# Altium schematic sheet power DCDC steup 33.SchDoc
size Letter
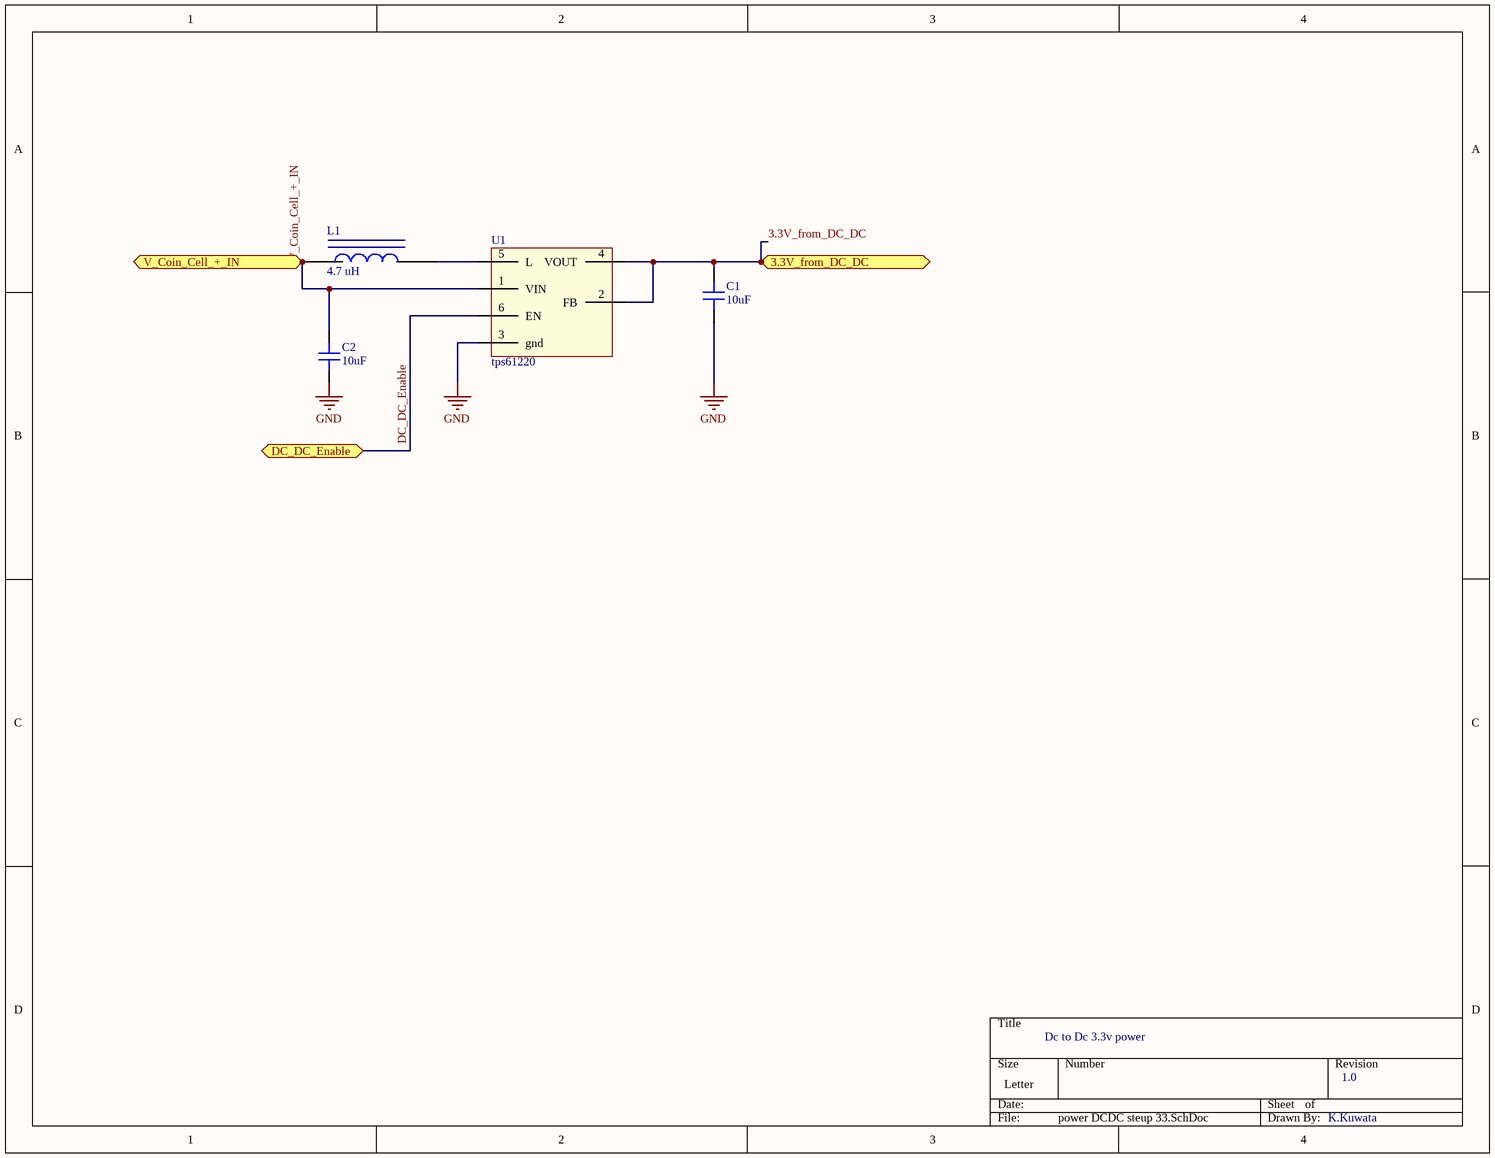
[diagram p0: power DCDC steup 33.SchDoc]

## Parts
C1  10uF  [CAP 0402/1005]
C2  10uF  [CAP 0402/1005]
L1  4.7 uH  [4.7 uH 1008 case]
U1  tps61220  [SOT65P210X110-6N]

## Ports
3.3V_from_DC_DC, DC_DC_Enable, V_Coin_Cell_+_IN

## Nets
GND: C1.1 C2.1 U1.3(gnd)
3.3V_from_DC_DC: C1.2 U1.2(FB) U1.4(VOUT) ; port 3.3V_from_DC_DC
DC_DC_Enable: U1.6(EN) ; port DC_DC_Enable
V_Coin_Cell_+_IN: C2.2 L1.1 U1.1(VIN) ; port V_Coin_Cell_+_IN
NetL1_2: L1.2 U1.5(L)

## Notes on the sheet
- Dc to Dc 3.3v power
- 1.0
- K.Kuwata

## Library data of the parts
C1 C2 = C1005X7R1C104K050BC: CAP CER 0.1UF 16V X7R 0402; Manufacturer: TDK Corporation; TemperatureRange: -55C ~ 125C; Tolerance: 10%; Voltage: 10; Value: 10uF; Part Number: C1005X7R1C104K050BC; PartId: 3856; Supplier 1: Digi-Key; Supplier Part Number 1: 445-4952-2-ND; ComponentLink1Description: Datasheet; ComponentLink1URL: https://product.tdk.com/info/en/catalog/datasheets/mlcc_commercial_general_en.pdf; ComponentLink2Description: Digi-Key listing; ComponentLink2URL: http://digikey.com/product-detail/en/C1005X7R1C104K050BC/445-4952-2-ND/2093220; TemperatureCoefficient: X7R; Price: 0.0066; Type: -; Device Package: 0402 (1005 Metric)
L1 = inductor: Value: 4.7 uH